# EAGLE design LPC812_breakout_v0.8 no lr (EAGLE 6.5.0)
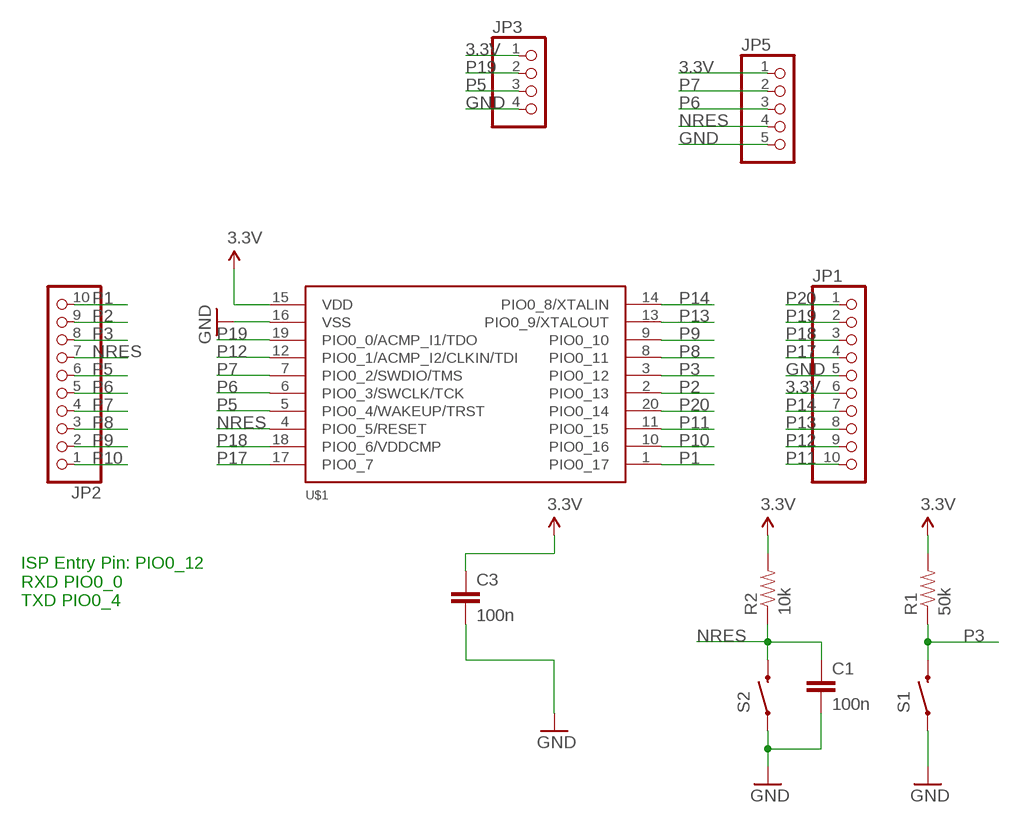
[diagram p0: schematic, sheet 1]

## Parts
C1  100n  CAP0805  [0805]
C3  100n  CAP0805  [0805]
JP1  HEADER-1X10ROUND  [1X10_ROUND]
JP2  HEADER-1X10ROUND  [1X10_ROUND]
JP3  HEADER-1X4ROUND  [1X04_ROUND]
JP5  HEADER-1X5ROUND  [1X05_ROUND]
R1  50k  RESISTOR0805-RES  [0805]
R2  10k  RESISTOR0805-RES  [0805]
S1  SWITCH-MOMENTARY-2-SMD-1101NE  [TACTILE-SWITCH-1101NE]
S2  SWITCH-MOMENTARY-2-SMD-1101NE  [TACTILE-SWITCH-1101NE]
U$1  LPC812M101JDH20  [TSSOP20]

## Nets
3.3V: C3.1 JP1.6 JP3.1 JP5.1 R1.2 R2.2 U$1.15(VDD)
GND: C1.2 C3.2 JP1.5 JP3.4 JP5.5 S1.P$1 S2.P$1 U$1.16(VSS)
NRES: C1.1 JP2.7 JP5.4 R2.1 S2.P$2 U$1.4(PIO0_5/RESET)
P1: JP2.10 U$1.1(PIO0_17)
P2: JP2.9 U$1.2(PIO0_13)
P3: JP2.8 R1.1 S1.P$2 U$1.3(PIO0_12)
P5: JP2.6 JP3.3 U$1.5(PIO0_4/WAKEUP/TRST)
P6: JP2.5 JP5.3 U$1.6(PIO0_3/SWCLK/TCK)
P7: JP2.4 JP5.2 U$1.7(PIO0_2/SWDIO/TMS)
P8: JP2.3 U$1.8(PIO0_11)
P9: JP2.2 U$1.9(PIO0_10)
P10: JP2.1 U$1.10(PIO0_16)
P11: JP1.10 U$1.11(PIO0_15)
P12: JP1.9 U$1.12(PIO0_1/ACMP_I2/CLKIN/TDI)
P13: JP1.8 U$1.13(PIO0_9/XTALOUT)
P14: JP1.7 U$1.14(PIO0_8/XTALIN)
P17: JP1.4 U$1.17(PIO0_7)
P18: JP1.3 U$1.18(PIO0_6/VDDCMP)
P19: JP1.2 JP3.2 U$1.19(PIO0_0/ACMP_I1/TDO)
P20: JP1.1 U$1.20(PIO0_14)

## Notes on the sheet
- ISP Entry Pin: PIO0_12
  RXD PIO0_0
  TXD PIO0_4

## Library data of the parts
C1 C3 = SparkFun-Capacitors:CAP: Capacitor Standard 0603 ceramic capacitor, and 0.1" leaded capacitor.
JP1 JP2 = microbuilder:HEADER-1X10: PIN HEADER
JP3 = microbuilder:HEADER-1X4: PIN HEADER
JP5 = microbuilder:HEADER-1X5: PIN HEADER
R1 R2 = SparkFun-Resistors:RESISTOR: Resistor Basic schematic elements and footprints for 0603, 1206, and PTH resistors.
S1 S2 = SparkFun-Electromechanical:SWITCH-MOMENTARY-2: Various NO switches- pushbuttons, reed, etc
U$1 = LPC800:LPC812M101JDH20

## Board
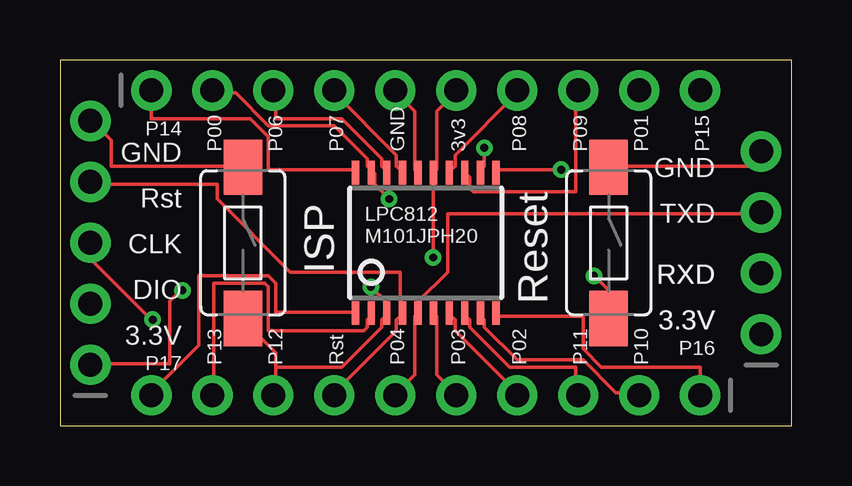
[diagram p1: board, top side]
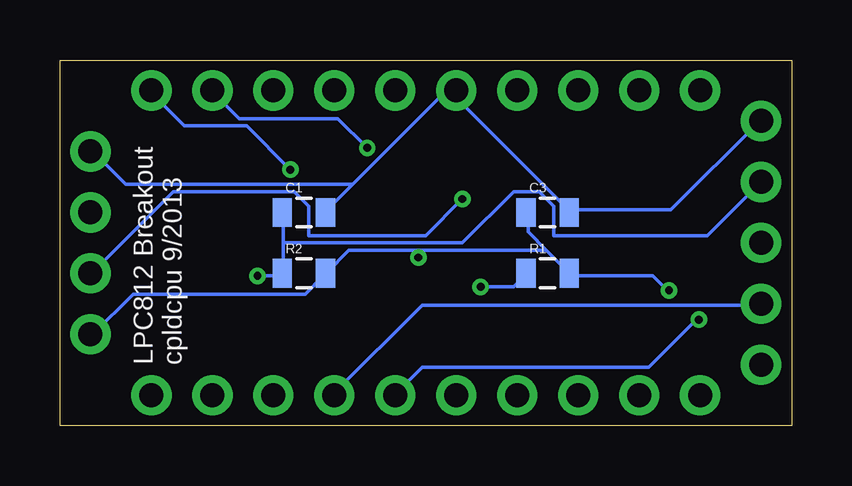
[diagram p2: board, bottom side, seen from below]

Size 30.48 x 15.24 mm. Coordinates in mm from the lower left corner, seen from the top.
Outline: 0,0 30.48,0 30.48,15.24 0,15.24 0,0
Copper layers (1*16): Top 0.0356mm / dielectric 1.5011mm / Bottom 0.0356mm
Design rules "LaenPCBOrder": minimum track width 6mil, minimum drill 13mil, track to track 6mil, track to pad 6mil, pad to pad 6mil, via to via 6mil, smd to smd 6mil, copper to edge 15mil, drill to drill 6mil, minimum pad ring 7mil, minimum via ring 7mil, stop-mask expansion 3mil, vias tented up to drill 0mil, thermal gap 10mil

### Footprints (pad centres in the part's own frame; a part is rotated, then mirrored left to right if it is on the bottom)
0805 = smd 0.8 x 1.2: 1 -0.9,0; 2 0.9,0
1X10_ROUND = drill 1 pad 1.676: 1 -11.43,0; 2 -8.89,0; 3 -6.35,0; 4 -3.81,0; 5 -1.27,0; 6 1.27,0; 7 3.81,0; 8 6.35,0; 9 8.89,0; 10 11.43,0
1X04_ROUND = drill 1 pad 1.676: 1 -3.81,0; 2 -1.27,0; 3 1.27,0; 4 3.81,0
1X05_ROUND = drill 1 pad 1.676: 1 -5.08,0; 2 -2.54,0; 3 0,0; 4 2.54,0; 5 5.08,0
TACTILE-SWITCH-1101NE = smd 2.3 x 1.6: P$1 -3.15,0; P$2 3.15,0
TSSOP20 = smd 0.305 x 0.991: 1 -2.925,-2.918; 2 -2.275,-2.918; 3 -1.625,-2.918; 4 -0.975,-2.918; 5 -0.325,-2.918; 6 0.325,-2.918; 7 0.975,-2.918; 8 1.625,-2.918; 9 2.275,-2.918; 10 2.925,-2.918; 11 2.925,2.918; 12 2.275,2.918; 13 1.625,2.918; 14 0.975,2.918; 15 0.325,2.918; 16 -0.325,2.918; 17 -0.975,2.918; 18 -1.625,2.918; 19 -2.275,2.918; 20 -2.925,2.918

### Placement (x,y rotation side)
C1  20.32,8.89 0 bottom
C3  10.16,8.89 0 bottom
JP1  15.24,13.97 0 top
JP2  15.24,1.27 180 top
JP3  29.21,7.62 90 top
JP5  1.27,7.62 90 top
R1  10.16,6.35 0 bottom
R2  20.32,6.35 0 bottom
S1  7.62,7.62 270 top
S2  22.86,7.62 270 top
U$1  15.24,7.62 0 top

### Tracks (layer width: path | path; a pad name or v marks a point on that pad's centre or on a via)
3.3V  (via drill 0.33)
  Top 0.152: JP1.6 16.46,13.87 15.7,13.11 15.7,10.67 U$1.15 15.54,10.52 v15.54,7.01 | JP5.1 1.37,2.59 4.57,2.59 4.57,5.18 5.03,5.64 v5.11,5.64
  Bottom 0.152: 10.21,7.32 10.97,8.08 10.97,8.84 C3.1 | 10.21,7.32 9.3,6.4 R1.2 9.14,6.25 5.79,6.25 5.18,5.64 v5.11,5.64 | 10.21,7.32 15.54,7.32 | 15.54,7.32 18.44,7.32 19.36,6.4 R2.2 19.51,6.25 20.27,5.49 27.43,5.49 29.11,3.81 JP3.1 | 15.54,7.32 v15.54,7.01
GND
  Top 0.152: S1.P$1 7.62,10.82 2.13,10.82 2.13,11.89 1.37,12.65 JP5.5 | S2.P$1 22.86,10.82 29.11,10.82 29.11,11.43 JP3.4 | U$1.16 14.78,10.67 14.78,13.11 14.02,13.87 JP1.5
  Bottom 0.152: 18.29,10.06 14.48,13.87 14.02,13.87 JP1.5 13.87,13.87 13.87,13.56 9.3,8.99 C3.2 9.14,8.99 5.03,8.99 1.37,12.65 JP5.5 | 18.29,10.06 19.36,8.99 C1.2 | 18.29,10.06 27.74,10.06 29.11,11.43 JP3.4
NRES  (via drill 0.33)
  Top 0.152: v22.25,6.25 22.86,5.64 S2.P$2 | JP2.7 11.43,1.37 14.02,3.96 14.02,4.42 14.17,4.57 U$1.4 14.17,4.72 14.17,6.4 9.6,6.4 6.55,9.45 6.55,10.06 1.37,10.06 JP5.4
  Bottom 0.152: 21.18,7.62 21.18,8.84 C1.1 | 21.18,7.62 21.18,6.4 R2.1 21.34,6.25 v22.25,6.25 | 21.18,7.62 13.72,7.62 11.58,9.75 10.52,9.75 9.91,9.14 9.91,7.92 3.5,7.92 JP5.4
P1
  Top 0.152: U$1.1 12.19,4.72 8.99,4.72 8.99,5.94 8.69,6.25 5.79,6.25 5.79,3.35 3.81,1.37 JP2.10
P2
  Top 0.152: U$1.2 12.95,4.57 12.8,4.42 12.8,4.12 12.65,3.96 8.69,3.96 8.69,5.79 8.53,5.94 6.4,5.94 6.4,1.37 JP2.9
P3  (via drill 0.33)
  Top 0.152: 8.99,2.44 11.73,2.44 13.41,4.12 13.41,4.42 13.56,4.57 U$1.3 13.56,4.72 13.56,5.18 v12.95,5.79 | 8.99,2.44 8.99,1.37 JP2.8 | 8.99,2.44 8.99,3.05 7.62,4.42 S1.P$2
  Bottom 0.152: v12.95,5.79 11.58,5.79 11.12,6.25 R1.1
P5
  Top 0.152: JP2.6 14.02,1.37 14.78,2.13 14.78,4.57 U$1.5 14.94,4.72 14.94,5.18 16.15,6.4 16.15,8.84 29.11,8.84 JP3.3
P6  (via drill 0.33)
  Top 0.152: U$1.6 15.7,4.57 15.7,2.13 16.46,1.37 JP2.5 | v3.86,4.42 3.81,4.42 1.37,6.86 1.37,7.62 JP5.3
  Bottom 0.152: 15.39,2.44 16.46,1.37 JP2.5 | 5.94,2.44 3.96,4.42 v3.86,4.42 | 15.39,2.44 5.94,2.44 | 15.39,2.44 5.94,2.44
P7
  Top 0.152: U$1.7 16.31,4.57 16.46,4.42 16.46,3.96 19.05,1.37 JP2.4
  Bottom 0.152: JP5.2 1.37,5.03 15.39,5.03 19.05,1.37 JP2.4
P8
  Top 0.152: U$1.8 16.92,4.57 17.07,4.42 17.07,4.12 18.75,2.44 21.49,2.44 21.49,1.37 JP2.3
P9
  Top 0.152: U$1.9 17.53,4.57 17.68,4.42 17.68,4.12 19.05,2.74 21.79,2.74 23.16,1.37 24.08,1.37 JP2.2
P10
  Top 0.152: JP2.1 26.67,2.44 22.55,2.44 21.79,3.2 21.79,4.57 18.29,4.57 U$1.10
P11  (via drill 0.33)
  Top 0.152: v20.88,10.67 18.29,10.67 U$1.11
  Bottom 0.152: v20.88,10.67 22.71,12.5 25.3,12.5 26.67,13.87 JP1.10
P12  (via drill 0.33)
  Top 0.152: v17.68,11.58 17.68,10.82 17.53,10.67 U$1.12
  Bottom 0.152: v17.68,11.58 18.9,12.8 23.01,12.8 24.08,13.87 JP1.9
P13
  Top 0.152: U$1.13 16.92,10.52 17.07,10.36 17.07,9.91 17.22,9.75 21.49,9.75 21.49,13.87 JP1.8
P14
  Top 0.152: U$1.14 16.31,10.67 16.46,10.82 16.46,11.28 19.05,13.87 JP1.7
P17
  Top 0.152: 14.02,11.28 14.02,10.82 14.17,10.67 U$1.17 | 11.43,13.87 14.02,11.28 | 11.43,13.87 JP1.4 | 11.43,13.87 14.02,11.28
P18
  Top 0.152: U$1.18 13.56,10.67 13.41,10.82 13.41,11.12 11.73,12.8 8.99,12.8 8.99,13.87 JP1.3
P19  (via drill 0.33)
  Top 0.152: JP1.2 6.4,13.87 7.32,13.87 8.69,12.5 11.43,12.5 12.8,11.12 12.8,10.82 12.95,10.67 U$1.19 13.11,10.52 13.11,10.06 v13.72,9.45
  Bottom 0.152: v13.72,9.45 15.24,7.92 20.12,7.92 20.12,9.14 20.73,9.75 25.76,9.75 29.11,6.4 JP3.2
P20
  Top 0.152: JP1.1 3.81,12.8 7.92,12.8 8.69,12.04 8.69,10.67 12.19,10.67 U$1.20

### Text on the board
tPlace: P14 | GND | P00 | P06 | P07 | GND | 3v3 | P08 | P09 | P01 | P15 | GND | Rst | TXD | CLK | LPC812 / M101JPH20 | RXD | RXD | DIO | ISP | Reset | 3.3V | 3.3V | 3.3V | P16 | P17 | P13 | P12 | Rst | P04 | P03 | P02 | P11 | P10
bPlace: LPC812 Breakout / cpldcpu 9/2013